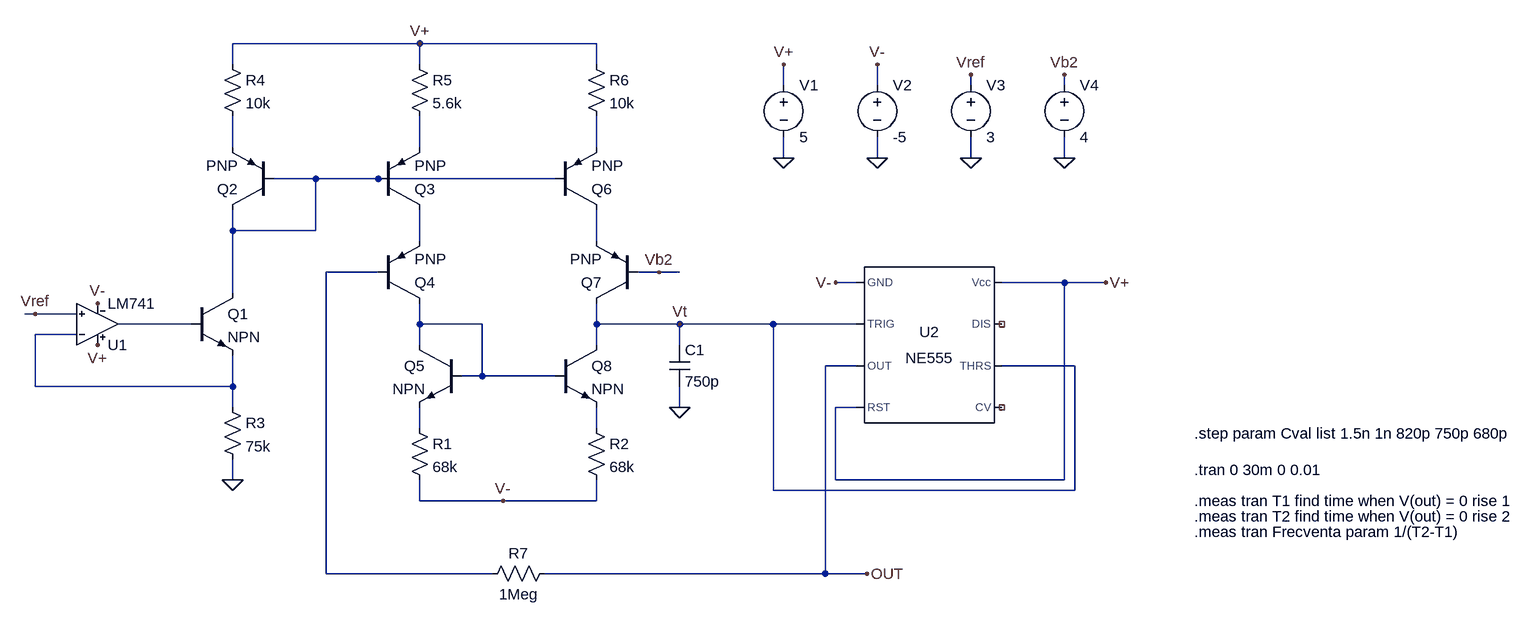
[diagram p0: schematic SCIA_Proiect_ConvertorVF.asc]
SCIA_Proiect_ConvertorVF.asc, the LTspice schematic file:
Version 4.1
SHEET 1 2332 688
WIRE 560 -304 272 -304
WIRE 832 -304 560 -304
WIRE 272 -272 272 -304
WIRE 560 -272 560 -304
WIRE 832 -272 832 -304
WIRE 1120 -240 1120 -272
WIRE 1264 -240 1264 -272
WIRE 1408 -240 1408 -256
WIRE 1552 -240 1552 -256
WIRE 272 -144 272 -192
WIRE 560 -144 560 -192
WIRE 832 -144 832 -192
WIRE 1120 -128 1120 -160
WIRE 1264 -128 1264 -160
WIRE 1408 -128 1408 -160
WIRE 1552 -128 1552 -160
WIRE 400 -96 336 -96
WIRE 496 -96 400 -96
WIRE 768 -96 496 -96
WIRE 272 -16 272 -48
WIRE 400 -16 400 -96
WIRE 400 -16 272 -16
WIRE 560 0 560 -48
WIRE 832 0 832 -48
WIRE 496 48 416 48
WIRE 928 48 896 48
WIRE 960 48 928 48
WIRE 1232 64 1200 64
WIRE 1552 64 1456 64
WIRE 1616 64 1552 64
WIRE 272 80 272 -16
WIRE -32 112 -48 112
WIRE 32 112 -32 112
WIRE 208 128 96 128
WIRE 560 128 560 96
WIRE 656 128 560 128
WIRE 832 128 832 96
WIRE 960 128 832 128
WIRE 1104 128 960 128
WIRE 1232 128 1104 128
WIRE 32 144 -32 144
WIRE 560 160 560 128
WIRE 832 160 832 128
WIRE 960 160 960 128
WIRE 1232 192 1184 192
WIRE 1568 192 1456 192
WIRE 656 208 656 128
WIRE 656 208 624 208
WIRE 768 208 656 208
WIRE -32 224 -32 144
WIRE 272 224 272 176
WIRE 272 224 -32 224
WIRE 272 256 272 224
WIRE 960 256 960 224
WIRE 1232 256 1200 256
WIRE 560 288 560 256
WIRE 832 288 832 256
WIRE 272 368 272 336
WIRE 1200 368 1200 256
WIRE 1552 368 1552 64
WIRE 1552 368 1200 368
WIRE 1104 384 1104 128
WIRE 1568 384 1568 192
WIRE 1568 384 1104 384
WIRE 560 400 560 368
WIRE 688 400 560 400
WIRE 832 400 832 368
WIRE 832 400 688 400
WIRE 416 512 416 48
WIRE 672 512 416 512
WIRE 1184 512 1184 192
WIRE 1184 512 752 512
WIRE 1248 512 1184 512
FLAG -32 112 Vref
FLAG 272 368 0
FLAG 560 -304 V+
FLAG 928 48 Vb2
FLAG 688 400 V-
FLAG 1200 64 V-
FLAG 960 256 0
FLAG 1616 64 V+
FLAG 64 96 V-
FLAG 64 160 V+
FLAG 1248 512 OUT
FLAG 1120 -128 0
FLAG 1264 -128 0
FLAG 1408 -128 0
FLAG 1552 -128 0
FLAG 1120 -272 V+
FLAG 1264 -272 V-
FLAG 1408 -256 Vref
FLAG 1552 -256 Vb2
FLAG 960 128 Vt
SYMBOL LM741 64 192 M180
SYMATTR InstName U1
SYMBOL Misc\\NE555 1344 160 R0
SYMATTR InstName U2
SYMBOL npn 208 80 R0
SYMATTR InstName Q1
SYMBOL res 256 240 R0
SYMATTR InstName R3
SYMATTR Value 75k
SYMBOL pnp 336 -48 R180
SYMATTR InstName Q2
SYMBOL res 256 -288 R0
SYMATTR InstName R4
SYMATTR Value 10k
SYMBOL pnp 496 -48 M180
SYMATTR InstName Q3
SYMBOL res 544 -288 R0
SYMATTR InstName R5
SYMATTR Value 5.6k
SYMBOL pnp 768 -48 M180
SYMATTR InstName Q6
SYMBOL res 816 -288 R0
SYMATTR InstName R6
SYMATTR Value 10k
SYMBOL pnp 496 96 M180
SYMATTR InstName Q4
SYMBOL pnp 896 96 R180
SYMATTR InstName Q7
SYMBOL npn 624 160 M0
SYMATTR InstName Q5
SYMBOL npn 768 160 R0
SYMATTR InstName Q8
SYMBOL res 544 272 R0
SYMATTR InstName R1
SYMATTR Value 68k
SYMBOL res 816 272 R0
SYMATTR InstName R2
SYMATTR Value 68k
SYMBOL res 768 496 R90
WINDOW 0 0 56 VBottom 2
WINDOW 3 32 56 VTop 2
SYMATTR InstName R7
SYMATTR Value 1Meg
SYMBOL cap 944 160 R0
SYMATTR InstName C1
SYMATTR Value 750p
SYMBOL voltage 1120 -256 R0
SYMATTR InstName V1
SYMATTR Value 5
SYMBOL voltage 1264 -256 R0
SYMATTR InstName V2
SYMATTR Value -5
SYMBOL voltage 1408 -256 R0
SYMATTR InstName V3
SYMATTR Value 3
SYMBOL voltage 1552 -256 R0
SYMATTR InstName V4
SYMATTR Value 4
TEXT 1752 400 Left 2 !.meas tran T1 find time when V(out) = 0 rise 1
TEXT 1752 424 Left 2 !.meas tran T2 find time when V(out) = 0 rise 2
TEXT 1752 448 Left 2 !.meas tran Frecventa param 1/(T2-T1)
TEXT 1752 352 Left 2 !.tran 0 30m 0 0.01
TEXT 1752 296 Left 2 !.step param Cval list 1.5n 1n 820p 750p 680p

The netlist it stands for:
* SCIA_Proiect_ConvertorVF.asc
X§U1 Vref N010 V+ V- N008 LM741  ; pins In+ In- V+ V- OUT
X§U2 V- Vt OUT V+ NC_01 Vt NC_02 V+ NE555  ; pins GND TRIG OUT RST CV THRS DIS Vcc
Q1 N004 N008 N010 0 NPN
R3 N010 0 75k
Q2 N004 N004 N001 0 PNP
R4 V+ N001 10k
Q3 N005 N004 N002 0 PNP
R5 V+ N002 5.6k
Q6 N006 N004 N003 0 PNP
R6 V+ N003 10k
Q4 N009 N007 N005 0 PNP
Q7 Vt Vb2 N006 0 PNP
Q5 N009 N009 N011 0 NPN
Q8 Vt N009 N012 0 NPN
R1 N011 V- 68k
R2 N012 V- 68k
R7 OUT N007 1Meg
C1 Vt 0 750p
V1 V+ 0 5
V2 V- 0 -5
V3 Vref 0 3
V4 Vb2 0 4
.model NPN NPN
.model PNP PNP
.lib standard.bjt
.meas tran T1 find time when V(out) = 0 rise 1
.meas tran T2 find time when V(out) = 0 rise 2
.meas tran Frecventa param 1/(T2-T1)
.tran 0 30m 0 0.01
.step param Cval list 1.5n 1n 820p 750p 680p
.lib LM741.lib
.lib NE555.sub
.backanno
.end